# Altium schematic sheet pca10056_sheet7_power_supply.SchDoc: PCA10056 - Power Supply
size A3; Revision: 0.9.0; SheetNumber: 7; SheetTotal: 7; Author: RUBR; DrawnBy: RUBR; ProjectNumber: 4440; PCBRevision: 0240RUBR; DocumentSize: A3; PCAName: PCA10056; PCBNumber: 400236; ProjectName: nRF52840-DK
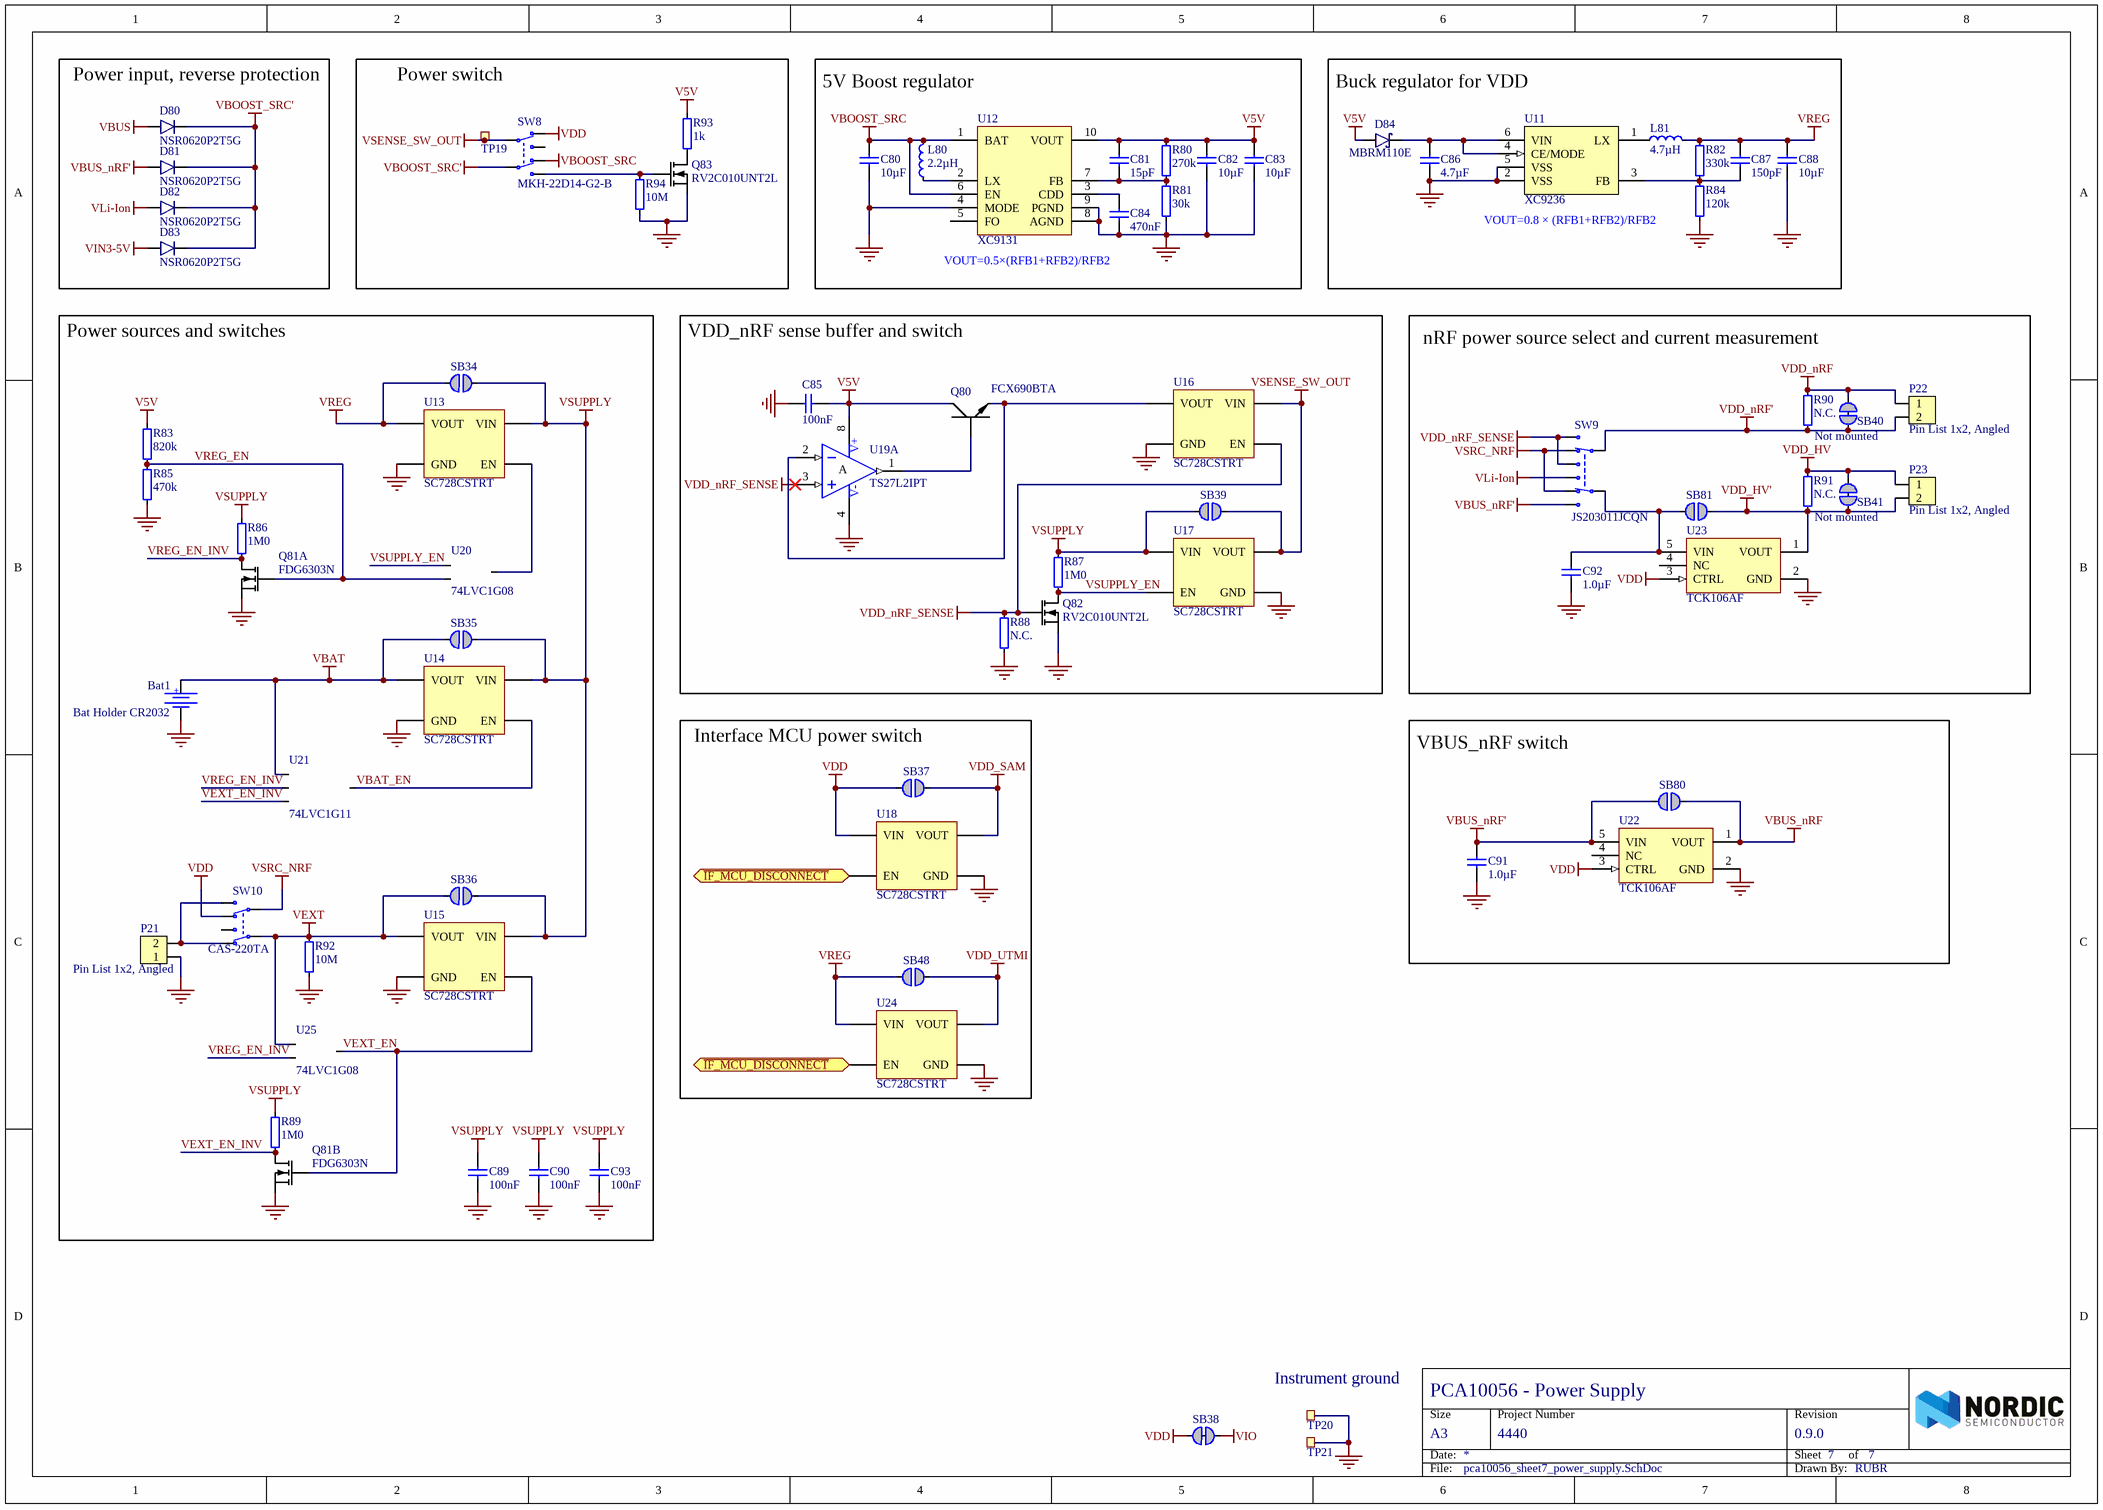
[diagram p0: pca10056_sheet7_power_supply.SchDoc]

## Parts
Bat1  Bat Holder CR2032  [CR2032_HOLDER_SMD]
C80  10µF  [CAPC1608X06L]
C81  15pF  [CAPC1005X04L]
C82  10µF  [CAPC1608X06L]
C83  10µF  [CAPC1608X06L]
C84  470nF  [CAPC1005X04L]
C85  100nF  [CAPC1005X04L]
C86  4.7µF  [CAPC2012X11L]
C87  150pF  [CAPC1005X04L]
C88  10µF  [CAPC1608X06L]
C89  100nF  [CAPC1005X04L]
C90  100nF  [CAPC1005X04L]
C91  1.0µF  [CAPC1608X06L]
C92  1.0µF  [CAPC1608X06L]
C93  100nF  [CAPC1005X04L]
D80  NSR0620P2T5G  [SODFL100X40-2N]
D81  NSR0620P2T5G  [SODFL100X40-2N]
D82  NSR0620P2T5G  [SODFL100X40-2N]
D83  NSR0620P2T5G  [SODFL100X40-2N]
D84  MBRM110E  [DO-216AA]
L80  2.2µH  [TY-NR3015]
L81  4.7µH  [TY-NR3015]
P21  Pin List 1x2, Angled  [LIST_ANG_1x2-SMD-2.54MM]
P22  Pin List 1x2, Angled  [LIST_ANG_1x2-SMD-2.54MM]
P23  Pin List 1x2, Angled  [LIST_ANG_1x2-SMD-2.54MM]
Q80  FCX690BTA  [SOT89-150P409X160-3N]
Q81  FDG6303N  [SOT65P210X100-6N]  (parts A,B of 2)
Q82  RV2C010UNT2L  [DFN65P100X40-3L]
Q83  RV2C010UNT2L  [DFN65P100X40-3L]
R80  270k  [RESC1005X04L]
R81  30k  [RESC1005X04L]
R82  330k  [RESC1005X04L]
R83  820k  [RESC1005X04L]
R84  120k  [RESC1005X04L]
R85  470k  [RESC1005X04L]
R86  1M0  [RESC1005X04L]
R87  1M0  [RESC1005X04L]
R88  N.C.  [RESC1005X04L]
R89  1M0  [RESC1005X04L]
R90  N.C.  Assembly: Not mounted  [RESC1005X04L]
R91  N.C.  Assembly: Not mounted  [RESC1005X04L]
R92  10M  [RESC1005X04L]
R93  1k  [RESC1005X04L]
R94  10M  [RESC1005X04L]
SB34  Solderbridge  [Solderbridge]  (value not drawn)  (no BOM)
SB35  Solderbridge  [Solderbridge]  (value not drawn)  (no BOM)
SB36  Solderbridge  [Solderbridge]  (value not drawn)  (no BOM)
SB37  Solderbridge  [Solderbridge]  (value not drawn)  (no BOM)
SB38  Solderbridge  [Solderbridge_Shorted]  (value not drawn)  (net tie, no BOM)
SB39  Solderbridge  [Solderbridge]  (value not drawn)  (no BOM)
SB40  Solderbridge  [Solderbridge_Shorted]  (value not drawn)  (net tie, no BOM)
SB41  Solderbridge  [Solderbridge_Shorted]  (value not drawn)  (net tie, no BOM)
SB48  Solderbridge  [Solderbridge]  (value not drawn)  (no BOM)
SB80  Solderbridge  [Solderbridge]  (value not drawn)  (no BOM)
SB81  Solderbridge  [Solderbridge]  (value not drawn)  (no BOM)
SW8  MKH-22D14-G2-B  [MKH-22D14-G2-B]
SW9  JS203011JCQN  [Switch-Slide-J-Lead-DP3T-13x3.5mm]
SW10  CAS-220TA  [CAS-220TA]
TP19  Ø1.0mm,SMD  [TP_SMD_Ø1.0mm]  (value not drawn)  (no BOM)
TP20  TP  [TESTPAD-TH]  (value not drawn)  (no BOM)
TP21  TP  [TESTPAD-TH]  (value not drawn)  (no BOM)
U11  XC9236  [USP-6C]
U12  XC9131  [10-USPB (2.9x2.6)]
U13  SC728CSTRT  [BGA4C40P2X2_76X76X62]
U14  SC728CSTRT  [BGA4C40P2X2_76X76X62]
U15  SC728CSTRT  [BGA4C40P2X2_76X76X62]
U16  SC728CSTRT  [BGA4C40P2X2_76X76X62]
U17  SC728CSTRT  [BGA4C40P2X2_76X76X62]
U18  SC728CSTRT  [BGA4C40P2X2_76X76X62]
U19  TS27L2IPT  [TSOP65P640X120-8N]  (part A of 2)
U20  74LVC1G08  [SOT65P210X100-5N]
U21  74LVC1G11  [SOT65P210X100-6N]
U22  TCK106AF  [SOT95P280X140-5N]
U23  TCK106AF  [SOT95P280X140-5N]
U24  SC728CSTRT  [BGA4C40P2X2_76X76X62]
U25  74LVC1G08  [SOT65P210X100-5N]

## Blocks framed on the sheet
Power input, reverse protection: D80-D83
Power switch: Q83 R93 R94 SW8 TP19
5V Boost regulator: C80-C84 L80 R80 R81 U12
Buck regulator for VDD: C86-C88 D84 L81 R82 R84 U11
Power sources and switches: Bat1 C89 C90 C93 P21 Q81 R83 R85 R86 R89 R92 SB34-SB36 SW10 U13-U15 U20 U21 U25
VDD_nRF sense buffer and switch: C85 Q80 Q82 R87 R88 SB39 U16 U17 U19
nRF power source select and current measurement: C92 P22 P23 R90 R91 SB40 SB41 SB81 SW9 U23
Interface MCU power switch: SB37 SB48 U18 U24
VBUS_nRF switch: C91 SB80 U22

## Ports
~{IF_MCU_DISCONNECT} (bidir)

## Nets
GND: Bat1.2 C80.1 C82.1 C83.1 C84.1 C85.1 C86.1 C88.1 C89.1 C90.1 C91.1 C92.1 C93.1 P21.1 Q81.1(S1) Q81.4(S2) Q82.2(S) Q83.2(S) R81.1 R84.1 R85.2 R88.2 R92.2 R94.2 TP20.1 TP21.1 U11.2(VSS) U11.5(VSS) U11.7(VSS) U12.4(MODE) U12.8(AGND) U12.9(PGND) U12.11(GND) U13.B1(GND) U14.B1(GND) U15.B1(GND) U16.B1(GND) U17.B1(GND) U18.B1(GND) U19.4(V-) U20.3(GND) U21.2(GND) U22.2(GND) U23.2(GND) U24.B1(GND) U25.3(GND)
V5V: C81.2 C82.2 C83.2 C85.2 D84.1(A) Q80.2(C) R80.2 R83.1 R93.1 U12.10(VOUT) U19.8(V+)
VBAT: Bat1.1 SB35.2 U14.A1(VOUT) U21.1(A)
VBOOST_SRC: C80.2 L80.2 SW8.6(N.C-2) U12.1(BAT) U12.6(EN)
VBOOST_SRC': D80.1(C) D81.1(C) D82.1(C) D83.1(C) SW8.5(COM-2)
VBUS: D80.2(A)
VBUS_nRF: SB80.1 U22.1(VOUT)
VBUS_nRF': C91.2 D81.2(A) SB80.2 SW9.8(N.O) U22.5(VIN)
VDD: SB37.2 SB38.2 SW8.3(N.C-1) SW10.6(N.C-2) U18.A2(VIN) U22.3(CTRL) U23.3(CTRL)
VDD_HV: P23.1 R91.2 SB41.1
VDD_HV': P23.2 R91.1 SB41.2 SB81.1 U23.1(VOUT)
VDD_nRF: P22.1 R90.2 SB40.1
VDD_nRF': P22.2 R90.1 SB40.2 SW9.3(COM)
VDD_nRF_SENSE: Q82.1(G) R88.1 SW9.1(N.O) SW9.4(N.O) U16.B2(EN) U19.3(IN1+)
VDD_SAM: SB37.1 U18.A1(VOUT)
VDD_UTMI: SB48.1 U24.A1(VOUT)
VEXT: R92.1 SB36.2 SW10.2(COM-1) U15.A1(VOUT) U25.1(A)
VIN3-5V: D83.2(A)
VIO: SB38.1
VLi-Ion: D82.2(A) SW9.5(N.O)
VREG: C87.2 C88.2 L81.2 R82.2 SB34.2 SB48.2 U13.A1(VOUT) U24.A2(VIN)
VSENSE_SW_OUT: SB39.1 SW8.2(COM-1) TP19.1 U16.A2(VIN) U17.A1(VOUT)
VSRC_NRF: SW9.2(N.C) SW9.6(N.C) SW10.5(COM-2)
VSUPPLY: C89.2 C90.2 C93.2 R86.1 R87.1 R89.1 SB34.1 SB35.1 SB36.1 SB39.2 U13.A2(VIN) U14.A2(VIN) U15.A2(VIN) U17.A2(VIN) U20.5(VCC) U21.5(VCC) U25.5(VCC)
~{IF_MCU_DISCONNECT}: U18.B2(EN) U24.B2(EN) ; port ~{IF_MCU_DISCONNECT}
VBAT_EN: U14.B2(EN) U21.4(Y)
VEXT_EN: Q81.5(G2) U15.B2(EN) U25.4(Y)
VEXT_EN_INV: Q81.3(D2) R89.2 U21.6(C)
VREG_EN: Q81.2(G1) R83.2 R85.1 U20.2(B)
VREG_EN_INV: Q81.6(D1) R86.2 U21.3(B) U25.2(B)
VSUPPLY_EN: Q82.3(D) R87.2 U17.B2(EN) U20.1(A)
NetC81_1: C81.1 R80.1 R81.2 U12.7(FB)
NetC84_2: C84.2 U12.3(CDD)
NetC86_2: C86.2 D84.3(C) U11.4(CE/MODE) U11.6(VIN)
NetC87_1: C87.1 R82.1 R84.2 U11.3(FB)
NetC92_2: C92.2 SB81.2 SW9.7(COM) U23.5(VIN)
NetL80_1: L80.1 U12.2(LX)
NetL81_1: L81.1 U11.1(LX)
NetP21_2: P21.2 SW10.3(N.C-1) SW10.4(N.O-2)
NetQ80_1: Q80.1(B) U19.1(OUT1)
NetQ80_3: Q80.3(E) U16.A1(VOUT) U19.2(IN1-)
NetQ83_1: Q83.1(G) R94.1 SW8.4(N.O-2)
NetQ83_3: Q83.3(D) R93.2
NetU13_B2: U13.B2(EN) U20.4(Y)

Not connected (* = marked no-connect by the designer): SW8 1(N.O-1); SW10 1(N.O-1); U12 5(FO); U22 4(NC); U23 4(NC)

## Notes on the sheet
- VOUT=0.8 × (RFB1+RFB2)/RFB2
- VOUT=0.5×(RFB1+RFB2)/RFB2
- (near TP20) Instrument ground
- Size
- Date:
- Project Number
- Sheet         of
- Revision
- File:
- Drawn By:
- (in symbol Bat Holder CR2032 SMD) +
- (in symbol TS27L2IPT, part A) A

## Library data of the parts
Bat1 = Bat Holder CR2032 SMD: Manufacturer: Comfortable; Manufacturer Part Number: BC-2001; 2nd source part number: 165-0693; Artikkelnr Noca: 55089011; Artikkelnr Simpro: N.A.; Part Number: Bat Holder CR2032 SMD; Datasheet: \\hizz\pro\app9717\Datasheet\connectores\Comfortable\BC-2001.pdf; Footprint Doc: CR2032_HOLDER_SMD; LatestRevisionDate: 2016-04-21; Pin Count: 3; Publisher: Nordic Semiconductor; Published: 2009-12-12; Value: Bat Holder CR2032; Note: Bat Holder CR2032; Supplier: Cabcon; Supplier part number: BC-2001/T & R; 2nd source Supplier: Farnell
C80 C82 C83 C88 = C0603-10µF-25V: Capacitor, 0603, 25V, X5R; Artikkelnr Noca: 20039436; Artikkelnr Simpro: N.A.; Part Number: C0603-10µF-25V; Manufacturer: *; Manufacturer Part Number: *; Datasheet: *; Footprint Doc: 0603; LatestRevisionDate: 2015-02-25; Pin Count: 2; Publisher: Nordic Semiconductor; Published: 2015-02-25; Value: 10µF; Note: 25V; Supplier: *; Supplier part number: *; 2nd source Supplier: *; 2nd source part number: *
C81 = C0402-15p: Capacitor, NP0, ±5%; Part number IPS: 00000002401; Note: 50V; Artikkelnr Noca: 20029141; Artikkelnr Simpro: N.A.; Part Number: C0402-15p; Manufacturer: *; Manufacturer Part Number: *; Datasheet: *; Footprint Doc: 0402; LatestRevisionDate: 2009-11-23; Pin Count: 2; Publisher: Nordic Semiconductor; Published: 2009-05-08; Value: 15pF; Supplier: *; Supplier part number: *; 2nd source Supplier: *; 2nd source part number: *
C84 = C0402-470n: Capacitor, X5R, ±10%; Note: 6.3V; Artikkelnr Noca: 20039350; Artikkelnr Simpro: N.A.; Part Number: C0402-470n; Manufacturer: *; Manufacturer Part Number: *; Datasheet: *; Footprint Doc: 0402; LatestRevisionDate: 2015-07-03; Pin Count: 2; Publisher: Nordic Semiconductor; Published: 2009-05-08; Value: 470nF; Supplier: *; Supplier part number: *; 2nd source Supplier: *; 2nd source part number: *
C85 C89 C90 C93 = C0402-100n: Capacitor, X7R, ±10%; Part number IPS: 00000005296; Note: 16V; Artikkelnr Noca: 20039200; Artikkelnr Simpro: N.A.; Part Number: C0402-100n; Manufacturer: *; Manufacturer Part Number: *; Datasheet: *; Footprint Doc: 0402; LatestRevisionDate: 2009-11-23; Pin Count: 2; Publisher: Nordic Semiconductor; Published: 2009-05-08; Value: 100nF; Supplier: *; Supplier part number: *; 2nd source Supplier: *; 2nd source part number: *
C86 = C0805-4µ7: Capacitor, X5R, ±10%; Note: 16V; Artikkelnr Noca: 20039266; Artikkelnr Simpro: N.A.; Part Number: C0805-4µ7; Manufacturer: *; Manufacturer Part Number: *; Datasheet: *; Footprint Doc: 0805; LatestRevisionDate: 2013-06-04; Pin Count: 2; Publisher: Nordic Semiconductor; Published: 2009-08-21; Value: 4.7µF; Supplier: *; Supplier part number: *; 2nd source Supplier: *; 2nd source part number: *
C87 = C0402-150p: Capacitor, NP0, ±5%; Note: 50V; Artikkelnr Noca: 20029111; Artikkelnr Simpro: N.A.; Part Number: C0402-150p; Manufacturer: *; Manufacturer Part Number: *; Datasheet: *; Footprint Doc: 0402; LatestRevisionDate: 2009-05-08; Pin Count: 2; Publisher: Nordic Semiconductor; Published: 2009-05-08; Value: 150pF; Supplier: *; Supplier part number: *; 2nd source Supplier: *; 2nd source part number: *
C91 C92 = C0603-1µ0: Capacitor, X7R, ±10%; Part number IPS: 00000000616; Note: 16V; Artikkelnr Noca: 20039335; Artikkelnr Simpro: N.A.; Part Number: C0603-1µ0; Manufacturer: *; Manufacturer Part Number: *; Datasheet: *; Footprint Doc: 0603; LatestRevisionDate: 2013-06-05; Pin Count: 2; Publisher: Nordic Semiconductor; Published: 2009-05-08; Value: 1.0µF; Supplier: *; Supplier part number: *; 2nd source Supplier: *; 2nd source part number: *
D80-D83 = NSR0620P2T5G: 20V schottky barrier diode, Vf 350 mV @ 100 mA, Ir 2.0 µA @ 10 V, If 500 mA; Manufacturer: ON Semiconductor; Artikkelnr Noca: 10029169; Artikkelnr Simpro: N.A.; Part Number: NSR0620P2T5G; Manufacturer Part Number: NSR0620P2T5G; Datasheet: http://www.onsemi.com/pub_link/Collateral/NSR0620P2-D.PDF; LatestRevisionDate: 2016-07-07; Publisher: Nordic Semiconductor; Published: 2016-07-07; Value: NSR0620P2T5G; Note: *; Supplier: Digi-Key; Supplier part number: NSR0620P2T5GOSCT-ND; 2nd source Supplier: *; 2nd source part number: *; Footprint Doc: SOD-923
D84 = MBRM110E: Diode Schottky Vf=0.455V @ 100mA, Vr=10V, If=1000mA, Ir=1µA @ 10V; Manufacturer: ON Semiconductor; Manufacturer Part Number: MBRM110ET1G; 2nd source part number: 236-9429; Artikkelnr Noca: 10029172; Artikkelnr Simpro: N.A.; Part Number: MBRM110E; Datasheet: http://media.digikey.com/pdf/Data%20Sheets/ON%20Semiconductor%20PDFs/MBRM110E-D.pdf; Footprint Doc: DO-216AA; LatestRevisionDate: 2016-10-24; Publisher: Nordic Semiconductor; Published: 2016-10-24; Value: MBRM110E; Note: *; Supplier: Digi-Key; Supplier part number: MBRM110ET1GOSTR-ND; 2nd source Supplier: Farnell
L80 = NR3015-2µ2-1.5A-72mOhm: Ferrite Inductor, Shielded, 1,5A, 72mOhm; Manufacturer: Taiyo Yuden; Manufacturer Part Number: NR3015T2R2M; 2nd source part number: 188-5853; Artikkelnr Noca: 33029487; Artikkelnr Simpro: N.A.; Part Number: NR3015-2µ2-1.5A-72mOhm; Datasheet: http://www.yuden.co.jp/ut/product/category/inductor/NR3015T2R2M.pdf; Footprint Doc: 1212; LatestRevisionDate: 2014-01-22; Pin Count: 2; Publisher: Nordic Semiconductor; Published: 2014-01-22; Value: 2.2µH; Note: *; Supplier: Digi-Key; Supplier part number: 587-1648-1-ND; 2nd source Supplier: Farnell
L81 = NR3015-4µ7-1.04A-144mOhm: Ferrite Inductor, Shielded, 1,04A, 144mOhm; Manufacturer: Taiyo Yuden; Manufacturer Part Number: NR3015T4R7M; 2nd source part number: 963-NR3015T4R7M; Artikkelnr Noca: 33029551; Artikkelnr Simpro: N.A.; Part Number: NR3015-4µ7-1.04A-144mOhm; Datasheet: http://www.yuden.co.jp/ut/product/category/inductor/NR3015T4R7M.pdf; Footprint Doc: 1212; LatestRevisionDate: 2014-01-22; Pin Count: 2; Publisher: Nordic Semiconductor; Published: 2014-01-22; Value: 4.7µH; Note: *; Supplier: Digi-Key; Supplier part number: 587-1649-1-ND; 2nd source Supplier: Mouser
P21-P23 = Pin List Ang 1x2 SMD, 2.54mm: Pin List 1x2, 2.54mm (100mil), Right Angled, SMD; Manufacturer: W-CON; Manufacturer Part Number: 1125B-1102S0Z135R2; 2nd source part number: TSM-102-01-L-SH-A; Artikkelnr Noca: 55010023; Artikkelnr Simpro: N.A.; Part Number: Pin List Ang 1x2 SMD, 2.54mm; Datasheet: \\hizz\pro\app9717\Datasheet\connectores\W-CON\1125B-11XXXXZXXXXX.pdf; Footprint Doc: LIST_ANG_1x2-SMD-2.54MM; LatestRevisionDate: 2016-05-26; Pin Count: 2; Publisher: Nordic Semiconductor; Published: 2016-01-22; Value: Pin List 1x2, Angled; Note: *; Supplier: Cabcon; Supplier part number: 1125B-1102S0Z135R2; 2nd source Supplier: Samtec
Q80 = FCX690BTA: 45V NPN high gain power transistor; Manufacturer: Diodes Incorporated; Artikkelnr Noca: 35010019; Artikkelnr Simpro: N.A.; Part Number: FCX690BTA; Manufacturer Part Number: FCX690BTA; Datasheet: http://www.diodes.com/_files/datasheets/FCX690B.pdf; Footprint Doc: SOT-89; LatestRevisionDate: 2016-07-07; Publisher: Nordic Semiconductor; Published: 2016-07-07; Value: FCX690BTA; Note: *; Supplier: Digi-Key; Supplier part number: FCX690BCT-ND; 2nd source Supplier: *; 2nd source part number: *
Q81 = FDG6303N: Fairchild, FDG6303N, Dual N-Channel Digital FET; 2nd source part number: FDG6303NCT-ND; Artikkelnr Noca: 35029086; Artikkelnr Simpro: N.A.; Part Number: FDG6303N; Manufacturer: Fairchild; Manufacturer Part Number: FDG6303N; Datasheet: http://www.fairchildsemi.com/ds/FD/FDG6303N.pdf; LatestRevisionDate: 2009-08-10; Pin Count: 6; Publisher: Nordic Semiconductor; Published: 2009-08-10; Value: FDG6303N; Note: Dual N-channel digital fet; Supplier: Farnell; Supplier part number: 161-1233; 2nd source Supplier: Digi-Key; Footprint Doc: SC70-6
Q82 Q83 = RV2C010UNT2L: N-Channel MOSFET, 20V, 1A, 470mOhm, 400mW; Manufacturer: Rohm Semiconductor; 2nd source part number: 755-RV2C010UNT2L; Artikkelnr Noca: 35010020; Artikkelnr Simpro: N.A.; Part Number: RV2C010UNT2L; Manufacturer Part Number: RV2C010UNT2L; Datasheet: http://rohmfs.rohm.com/en/products/databook/datasheet/discrete/transistor/mosfet/rv2c010unt2l-e.pdf; LatestRevisionDate: 2016-08-09; Publisher: Nordic Semiconductor; Published: 2016-08-09; Value: RV2C010UNT2L; Note: *; Supplier: Digi-Key; Supplier part number: RV2C010UNT2LCT-ND; 2nd source Supplier: Mouser; Footprint Doc: DFN-3
R80 = R0402-270k: Resistor, ±1%, 0.063W; Note: Chip Res 1%; Artikkelnr Noca: 27049131; Artikkelnr Simpro: N.A.; Value Ohm: 270000; Part Number: R0402-270k; Manufacturer: *; Manufacturer Part Number: *; Datasheet: *; Footprint Doc: 0402; LatestRevisionDate: 2009-11-23; Pin Count: 2; Publisher: Nordic Semiconductor; Published: 2009-05-08; Value: 270k; Supplier: *; Supplier part number: *; 2nd source Supplier: *; 2nd source part number: *
R81 = R0402-30k: Resistor, ±1%, 0.063W; Note: Chip Res 1%; Artikkelnr Noca: 27049108; Artikkelnr Simpro: N.A.; Value Ohm: 30000; Part Number: R0402-30k; Manufacturer: *; Manufacturer Part Number: *; Datasheet: *; Footprint Doc: 0402; LatestRevisionDate: 2016-06-02; Pin Count: 2; Publisher: Nordic Semiconductor; Published: 2014-10-08; Value: 30k; Supplier: *; Supplier part number: *; 2nd source Supplier: *; 2nd source part number: *
R82 = R0402-330k: Resistor, ±1%, 0.063W; Note: Chip Res 1%; Artikkelnr Noca: 27049133; Artikkelnr Simpro: N.A.; Value Ohm: 330000; Part Number: R0402-330k; Manufacturer: *; Manufacturer Part Number: *; Datasheet: *; Footprint Doc: 0402; LatestRevisionDate: 2009-11-23; Pin Count: 2; Publisher: Nordic Semiconductor; Published: 2009-05-08; Value: 330k; Supplier: *; Supplier part number: *; 2nd source Supplier: *; 2nd source part number: *
R83 = R0402-820k: Resistor, ±1%, 0.063W; Note: Chip Res 1%; Artikkelnr Noca: 27049143; Artikkelnr Simpro: N.A.; Value Ohm: 820000; Part Number: R0402-820k; Manufacturer: *; Manufacturer Part Number: *; Datasheet: *; LatestRevisionDate: 2009-11-23; Pin Count: 2; Publisher: Nordic Semiconductor; Published: 2009-05-08; Value: 820k; Supplier: *; Supplier part number: *; 2nd source Supplier: *; 2nd source part number: *; Footprint Doc: 0402
R84 = R0402-120k: Resistor, ±1%, 0.063W; Note: Chip Res 1%; Artikkelnr Noca: 27049123; Artikkelnr Simpro: N.A.; Value Ohm: 120000; Part Number: R0402-120k; Manufacturer: *; Manufacturer Part Number: *; Datasheet: *; Footprint Doc: 0402; LatestRevisionDate: 2009-11-23; Pin Count: 2; Publisher: Nordic Semiconductor; Published: 2009-05-08; Value: 120k; Supplier: Farnell; Supplier part number: 169-2508; 2nd source Supplier: *; 2nd source part number: *
R85 = R0402-470k: Resistor, ±1%, 0.063W; Note: Chip Res 1%; Artikkelnr Noca: 27049137; Artikkelnr Simpro: N.A.; Value Ohm: 470000; Part Number: R0402-470k; Manufacturer: *; Manufacturer Part Number: *; Datasheet: *; LatestRevisionDate: 2009-11-23; Pin Count: 2; Publisher: Nordic Semiconductor; Published: 2009-05-08; Value: 470k; Supplier: *; Supplier part number: *; 2nd source Supplier: *; 2nd source part number: *; Footprint Doc: 0402
R86 R87 R89 = R0402-1M0: Resistor, ±1%, 0.063W; Note: Chip Res 1%; Artikkelnr Noca: 27049145; Artikkelnr Simpro: N.A.; Value Ohm: 1000000; Part Number: R0402-1M0; Manufacturer: *; Manufacturer Part Number: *; Datasheet: *; LatestRevisionDate: 2009-11-23; Pin Count: 2; Publisher: Nordic Semiconductor; Published: 2009-05-08; Value: 1M0; Supplier: *; Supplier part number: *; 2nd source Supplier: *; 2nd source part number: *; Footprint Doc: 0402
R88 = R0402-N.C.: Not mounted; Note: Chip Res; Artikkelnr Noca: N.A.; Assembly: Not mounted; Part Number: R0402-N.C.; Manufacturer: *; Manufacturer Part Number: *; Datasheet: *; LatestRevisionDate: 2009-05-08; Pin Count: 2; Publisher: Nordic Semiconductor; Published: 2009-05-08; Value: N.C.; Supplier: *; Supplier part number: *; 2nd source Supplier: *; 2nd source part number: *; Footprint Doc: 0402; Artikkelnr Simpro: N.A.
R90 R91 = R0402-N.C.: Not mounted; Note: Chip Res; Artikkelnr Noca: N.A.; Part Number: R0402-N.C.; Manufacturer: *; Manufacturer Part Number: *; Datasheet: *; LatestRevisionDate: 2009-05-08; Pin Count: 2; Publisher: Nordic Semiconductor; Published: 2009-05-08; Value: N.C.; Supplier: *; Supplier part number: *; 2nd source Supplier: *; 2nd source part number: *; Footprint Doc: 0402; Artikkelnr Simpro: N.A.
R92 R94 = R0402-10M: Resistor, ±1%, 0.063W; Note: Chip Res 1%; Artikkelnr Noca: 27049169; Artikkelnr Simpro: N.A.; Value Ohm: 10000000; Part Number: R0402-10M; Manufacturer: *; Manufacturer Part Number: *; Datasheet: *; LatestRevisionDate: 2009-11-23; Pin Count: 2; Publisher: Nordic Semiconductor; Published: 2009-05-08; Value: 10M; Supplier: *; Supplier part number: *; 2nd source Supplier: *; 2nd source part number: *; Footprint Doc: 0402
R93 = R0402-1k0: Resistor, ±1%, 0.063W; Part number IPS: 00000002218; Note: Chip Res 1%; Artikkelnr Noca: 27049073; Artikkelnr Simpro: N.A.; Value Ohm: 1000; Part Number: R0402-1k0; Manufacturer: *; Manufacturer Part Number: *; Datasheet: *; LatestRevisionDate: 2009-11-23; Pin Count: 2; Publisher: Nordic Semiconductor; Published: 2009-05-08; Value: 1k; Supplier: Farnell; Supplier part number: 173-8850; 2nd source Supplier: *; 2nd source part number: *; Footprint Doc: 0402
SB34-SB37 SB39 SB48 SB80 SB81 = Solderbridge: Artikkelnr Noca: N.A.; Part Number: Solderbridge; Manufacturer: *; Manufacturer Part Number: *; Datasheet: *; LatestRevisionDate: 2009-12-14; Pin Count: 2; Publisher: Nordic Semiconductor; Published: 2009-12-14; Value: Solderbridge; Note: *; Supplier: *; Supplier part number: *; 2nd source Supplier: *; 2nd source part number: *; Footprint Doc: Solderbridge; Artikkelnr Simpro: N.A.
SB38 SB40 SB41 = Solderbridge Shorted: Shorted Solderbridge; Artikkelnr Noca: N.A.; Part Number: Solderbridge Shorted; Manufacturer: *; Manufacturer Part Number: *; Datasheet: *; LatestRevisionDate: 2012-08-07; Pin Count: 2; Publisher: Nordic Semiconductor; Published: 2012-08-07; Value: Solderbridge; Note: *; Supplier: *; Supplier part number: *; 2nd source Supplier: *; 2nd source part number: *; Footprint Doc: Solderbridge_Shorted; Artikkelnr Simpro: N.A.
SW8 = MKH-22D14-G2-B: Slide Switch DPDT; Manufacturer: Dailywell; Artikkelnr Noca: 50019112; Artikkelnr Simpro: N.A.; Part Number: MKH-22D14-G2-B; Manufacturer Part Number: MKH-22D14-G2-B; Datasheet: \\hizz\pro\app9717\Datasheet\switches\Dailywell\MKH-22D14-G2-B.pdf; Footprint Doc: MKH-22D14-G2-B; LatestRevisionDate: 2016-08-18; Pin Count: 6; Publisher: Nordic Semiconductor; Published: 2016-08-18; Value: MKH-22D14-G2-B; Note: *; Supplier: *; Supplier part number: *; 2nd source Supplier: *; 2nd source part number: *
SW9 = JS203011JCQN: Slide Switch DP3T 300mA 6V; Manufacturer: C&K Components; Artikkelnr Noca: 50019111; Artikkelnr Simpro: N.A.; Part Number: JS203011JCQN; Manufacturer Part Number: JS203011JCQN; Datasheet: http://www.ckswitches.com/media/1422/js.pdf; Footprint Doc: Switch-Slide-J-Lead-DP3T-13x3.5mm; LatestRevisionDate: 2016-10-05; Pin Count: 8; Publisher: Nordic Semiconductor; Published: 2016-10-05; Value: JS203011JCQN; Note: *; Supplier: Digi-Key; Supplier part number: CKN10725CT-ND; 2nd source Supplier: *; 2nd source part number: *
SW10 = CAS-220TA: Slide Switch DPDT J Hook; Manufacturer: Copal Electronics Inc; Artikkelnr Noca: 50019042; Artikkelnr Simpro: N.A.; Part Number: CAS-220TA; Manufacturer Part Number: CAS-220TA; Datasheet: http://media.digikey.com/pdf/Data%20Sheets/COPAL%20Electronics%20PDFs/CAS%20SMD%20Slide%20Switch.pdf; Footprint Doc: CAS-220TA; LatestRevisionDate: 2010-02-18; Pin Count: 6; Publisher: Nordic Semiconductor; Published: 2010-02-18; Value: CAS-220TA; Note: *; Supplier: Digi-Key; Supplier part number: CAS220JTR-ND; 2nd source Supplier: *; 2nd source part number: *
TP19 = TP_SMD_Ø1.0MM: 1.0mm circular SMD testpad; Manufacturer: Nordic Semiconductor; Artikkelnr Noca: N.A.; Part Number: TP_SMD_Ø1.0MM; Manufacturer Part Number: *; Datasheet: *; LatestRevisionDate: 2013-06-11; Pin Count: 1; Publisher: Nordic Semiconductor; Published: 2013-06-11; Value: Ø1.0mm,SMD; Note: *; Supplier: *; Supplier part number: *; 2nd source Supplier: *; 2nd source part number: *; Footprint Doc: TP_SMD_Ø1.0mm; Artikkelnr Simpro: N.A.
TP20 TP21 = Testpoint TH: Testpoint, through hole; Artikkelnr Noca: N.A.; Part Number: Testpoint TH; Manufacturer: *; Manufacturer Part Number: *; Datasheet: *; Footprint Doc: TESTPAD-TH; LatestRevisionDate: 2009-12-12; Pin Count: 1; Publisher: Nordic Semiconductor; Published: 2009-12-12; Value: TP; Note: *; Supplier: *; Supplier part number: *; 2nd source Supplier: *; 2nd source part number: *; Artikkelnr Simpro: N.A.
U11 = XC9236F08CER-G: 600mA Driver Transistor Built-In, Synchronous Step-Down DC/DC Converters; Manufacturer: Torex Semiconductor; Artikkelnr Noca: 17030085; Artikkelnr Simpro: N.A.; Part Number: XC9236F08CER-G; Manufacturer Part Number: XC9236F08CER-G; Datasheet: http://www.torexsemi.com/products/dcdc_converters/data/XC9235~37.pdf; Footprint Doc: USP-6C; LatestRevisionDate: 2016-08-08; Pin Count: 6; Publisher: Nordic Semiconductor; Published: 2016-08-08; Value: XC9236; Note: *; Supplier: Mouser; Supplier part number: 865-XC9236F08CER-G; 2nd source Supplier: *; 2nd source part number: *
U12 = XC9131H05CDR-G: 1A Driver Transistor Built-In, Multi Functional Step-Up DC/DC Converter; Manufacturer: Torex Semiconductor; Artikkelnr Noca: 17030086; Artikkelnr Simpro: N.A.; Part Number: XC9131H05CDR-G; Manufacturer Part Number: XC9131H05CDR-G; Datasheet: http://www.torexsemi.com/products/dcdc_converters/data/XC9131.pdf; Footprint Doc: UFDFN-10; LatestRevisionDate: 2016-08-08; Pin Count: 10; Publisher: Nordic Semiconductor; Published: 2016-08-08; Value: XC9131; Note: *; Supplier: Digi-Key; Supplier part number: XC9131H05CDR-G-ND; 2nd source Supplier: *; 2nd source part number: *
U13-U18 U24 = SC728CSTRT: Semtech, 2A Low Vin, Very Low Ron, Load Switch, 4DSBGA; Manufacturer: Semtech Corporation; 2nd source part number: 947-SC728CSTRT; Artikkelnr Noca: 15070081; Artikkelnr Simpro: N.A.; Part Number: SC728CSTRT; Manufacturer Part Number: SC728CSTRT; Datasheet: http://www.semtech.com/images/datasheet/sc728.pdf; Footprint Doc: WCSP-4; LatestRevisionDate: 2015-01-01; Pin Count: 4; Publisher: Nordic Semiconductor; Published: 2016-06-16; Value: SC728CSTRT; Note: *; Supplier: Digi-Key; Supplier part number: SC728CSTRTCT-ND; 2nd source Supplier: Mouser
U19 = TS27L2IPT: Precision very low power CMOS dual operational amplifier; Manufacturer: STMicroelectronics; Artikkelnr Noca: 17010019; Artikkelnr Simpro: N.A.; Part Number: TS27L2IPT; Manufacturer Part Number: TS27L2IPT; Datasheet: http://www.st.com/content/ccc/resource/technical/document/datasheet/38/5b/ca/bd/c0/26/4a/34/CD00000880.pdf/files/CD00000880.pdf/jcr:content/translations/en.CD00000880.pdf; Footprint Doc: TSSOP-8; LatestRevisionDate: 2016-07-07; Pin Count: 8; Publisher: Nordic Semiconductor; Published: 2016-07-07; Value: TS27L2IPT; Note: *; Supplier: Digi-Key; Supplier part number: 497-8085-1-ND; 2nd source Supplier: *; 2nd source part number: *
U20 U25 = 74LVC1G08GW: Single 2-Input AND Gate; Manufacturer: NXP Semiconductors; 2nd source part number: 242-8299; Artikkelnr Noca: 15049058; Artikkelnr Simpro: N.A.; Part Number: 74LVC1G08GW; Manufacturer Part Number: 74LVC1G08GW; Datasheet: http://www.nxp.com/documents/data_sheet/74LVC1G08.pdf; Footprint Doc: SC70-5; LatestRevisionDate: 2016-10-18; Pin Count: 5; Publisher: Nordic Semiconductor; Published: 2016-10-18; Value: 74LVC1G08; Note: Single 2-Input AND Gate; Supplier: Digi-Key; Supplier part number: 568-1580-1-ND; 2nd source Supplier: Farnell
U21 = 74LVC1G11GW: Single 3-input AND gate; Manufacturer: NXP Semiconductors; 2nd source part number: 243-8826; Artikkelnr Noca: 15079348; Artikkelnr Simpro: N.A.; Part Number: 74LVC1G11GW; Manufacturer Part Number: 74LVC1G11GW; Datasheet: http://www.nxp.com/documents/data_sheet/74LVC1G11.pdf; Footprint Doc: SC70-6; LatestRevisionDate: 2016-10-18; Pin Count: 6; Publisher: Nordic Semiconductor; Published: 2016-10-18; Value: 74LVC1G11; Note: Single 3-input AND gate; Supplier: Digi-Key; Supplier part number: 568-7757-1-ND; 2nd source Supplier: Farnell
U22 U23 = TCK106AF,LF: 1.0 A Load Switch IC with Slew Rate Control Driver in Small Package; Manufacturer: Toshiba; Artikkelnr Noca: 15070086; Artikkelnr Simpro: N.A.; Part Number: TCK106AF,LF; Manufacturer Part Number: TCK106AF,LF; Datasheet: https://toshiba.semicon-storage.com/info/docget.jsp?did=53240&prodName=TCK108AF; Footprint Doc: SOT-25; LatestRevisionDate: 2016-09-29; Pin Count: 5; Publisher: Nordic Semiconductor; Published: 2016-09-29; Value: TCK106AF; Note: *; Supplier: Digi-Key; Supplier part number: TCK106AFLFCT-ND; 2nd source Supplier: *; 2nd source part number: *